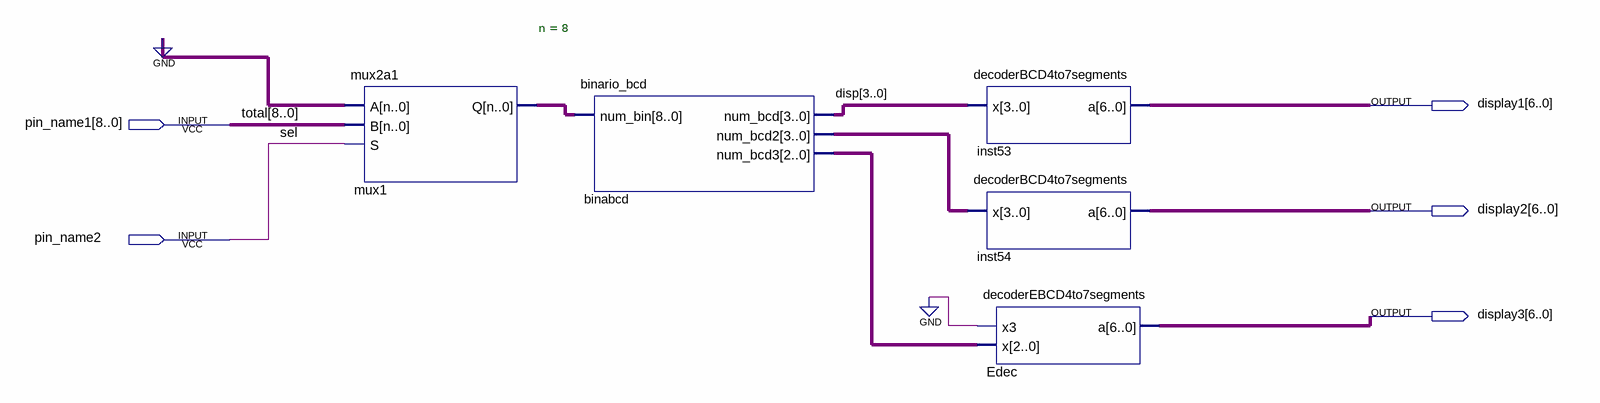
[diagram p0: schematic sheet]
// Quartus schematic Displaysblocks.bdf as structural Verilog: 5 symbols, 5 pins
module Displaysblocks (
  input  [8:0] pin_name1,
  input  pin_name2,
  output [6:0] display1,
  output [6:0] display2,
  output [6:0] display3
);

  wire [2:0] binabcd_num_bcd3;
  wire [3:0] binabcd_num_bcd2, disp;
  wire [8:0] mux1_q;

  mux2a1 #(.n(8)) mux1 (.A({9{1'b0}}), .B(pin_name1), .S(pin_name2), .Q(mux1_q));
  binario_bcd binabcd (.num_bin(mux1_q), .num_bcd(disp), .num_bcd2(binabcd_num_bcd2), .num_bcd3(binabcd_num_bcd3));
  decoderBCD4to7segments inst53 (.x(disp), .a(display1));
  decoderBCD4to7segments inst54 (.x(binabcd_num_bcd2), .a(display2));
  decoderEBCD4to7segments Edec (.x3(1'b0), .x(binabcd_num_bcd3), .a(display3));

  // Other names for the same wires on the sheet: sel = pin_name2; total[8:0] = pin_name1
endmodule
